# EAGLE design motor_driver (EAGLE 5.11)
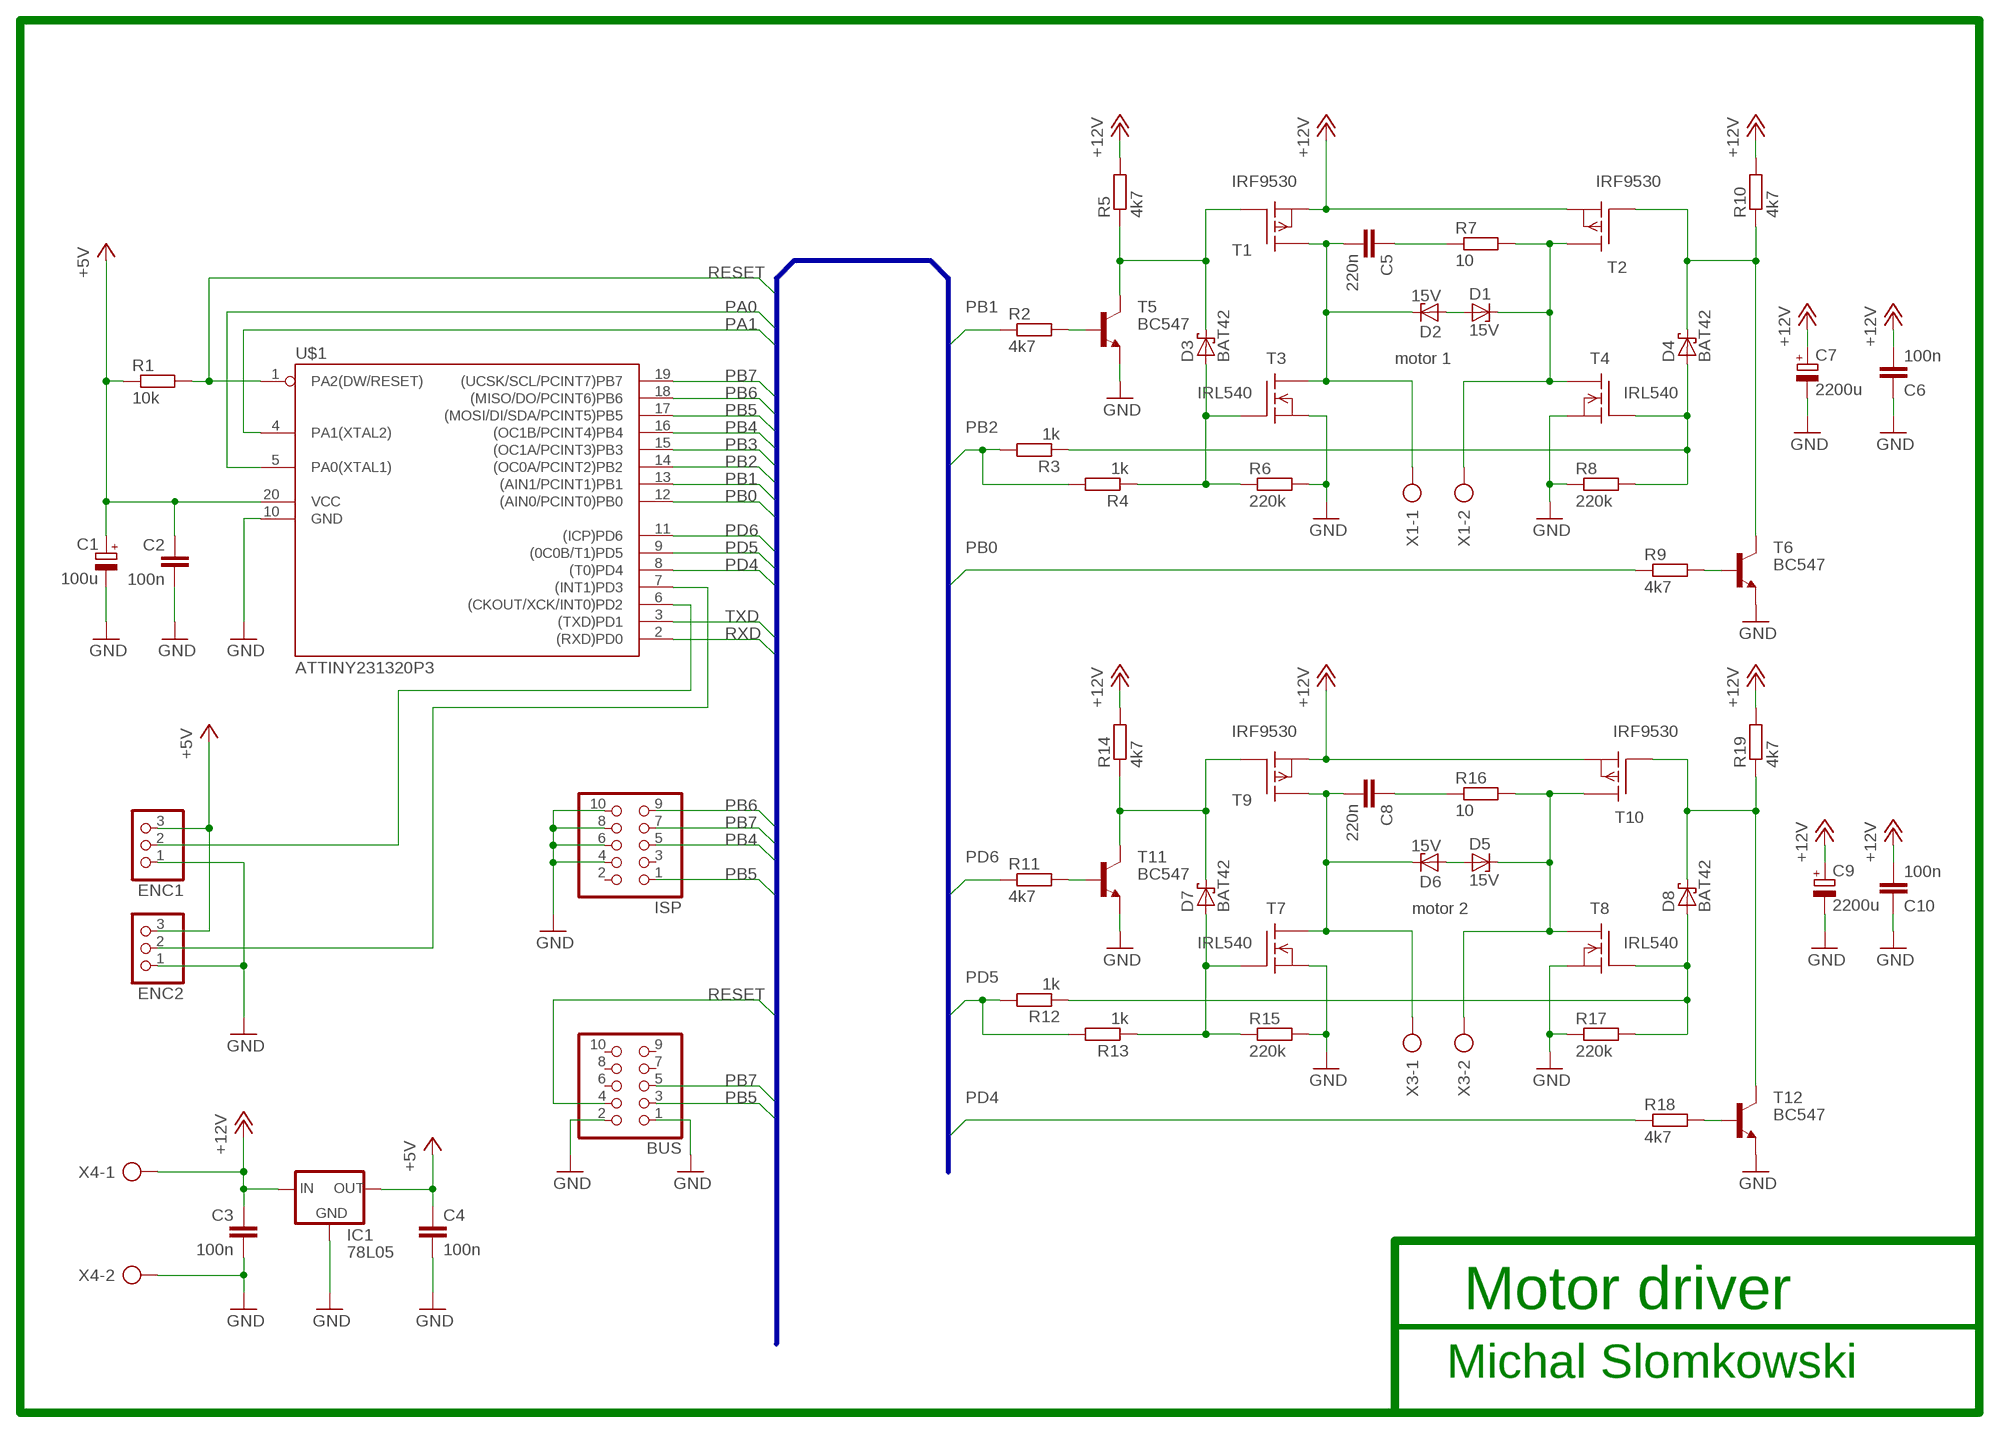
[diagram p0: schematic, sheet 1]

## Parts
BUS  PINHD-2X5  [2X05]
C1  100u  CPOL-EUE2.5-6  [E2,5-6]
C2  100n  C-EU050-035X075  [C050-035X075]
C3  100n  C-EU050-035X075  [C050-035X075]
C4  100n  C-EU050-035X075  [C050-035X075]
C5  220n  C-EU050-050X075  [C050-050X075]
C6  100n  C-EU050-050X075  [C050-050X075]
C7  2200u  CPOL-EUE5-13  [E5-13]
C8  220n  C-EU050-050X075  [C050-050X075]
C9  2200u  CPOL-EUE5-13  [E5-13]
C10  100n  C-EU050-050X075  [C050-050X075]
D1  15V  BZD23  [SOD81]
D2  15V  BZD23  [SOD81]
D3  BAT42  [DO35-10]
D4  BAT42  [DO35-10]
D5  15V  BZD23  [SOD81]
D6  15V  BZD23  [SOD81]
D7  BAT42  [DO35-10]
D8  BAT42  [DO35-10]
ENC1  PINHD-1X3  [1X03]
ENC2  PINHD-1X3  [1X03]
IC1  78L05  78LXX  [78LXX]
ISP  PINHD-2X5  [2X05]
R1  10k  R-EU_0204/7  [0204/7]
R2  4k7  R-EU_0204/7  [0204/7]
R3  1k  R-EU_0204/7  [0204/7]
R4  1k  R-EU_0204/7  [0204/7]
R5  4k7  R-EU_0204/7  [0204/7]
R6  220k  R-EU_0204/7  [0204/7]
R7  10  R-EU_0204/7  [0204/7]
R8  220k  R-EU_0204/7  [0204/7]
R9  4k7  R-EU_0204/7  [0204/7]
R10  4k7  R-EU_0204/7  [0204/7]
R11  4k7  R-EU_0204/7  [0204/7]
R12  1k  R-EU_0204/7  [0204/7]
R13  1k  R-EU_0204/7  [0204/7]
R14  4k7  R-EU_0204/7  [0204/7]
R15  220k  R-EU_0204/7  [0204/7]
R16  10  R-EU_0204/7  [0204/7]
R17  220k  R-EU_0204/7  [0204/7]
R18  4k7  R-EU_0204/7  [0204/7]
R19  4k7  R-EU_0204/7  [0204/7]
T1  IRF9530  [TO220]
T2  IRF9530  [TO220]
T3  IRL540  IRF540  [TO220]
T4  IRL540  IRF540  [TO220]
T5  BC547  [TO92]
T6  BC547  [TO92]
T7  IRL540  IRF540  [TO220]
T8  IRL540  IRF540  [TO220]
T9  IRF9530  [TO220]
T10  IRF9530  [TO220]
T11  BC547  [TO92]
T12  BC547  [TO92]
U$1  ATTINY231320P3  [DIL20]
X1  AK500/2  [AK500/2]
X3  AK500/2  [AK500/2]
X4  AK500/2  [AK500/2]

## Nets
+5V: C1.+ C2.1 C4.1 ENC1.3 ENC2.3 IC1.OUT R1.1 U$1.20(VCC)
+12V: C3.1 C6.2 C7.+ C9.+ C10.2 IC1.IN R5.2 R10.2 R14.2 R19.2 T1.3(S) T2.3(S) T9.3(S) T10.3(S) X4.1
GND: BUS.1 BUS.2 C1.- C2.2 C3.2 C4.2 C6.1 C7.- C9.- C10.1 ENC1.1 ENC2.1 IC1.GND ISP.4 ISP.6 ISP.8 ISP.10 R6.2 R8.1 R15.2 R17.1 T3.3(S) T4.3(S) T5.1(E) T6.1(E) T7.3(S) T8.3(S) T11.1(E) T12.1(E) U$1.10(GND) X4.2
N$2: D1.C R7.2 T2.2(D) T4.2(D) X1.2
N$3: D1.A D2.A
N$4: D3.C R5.1 T1.1(G) T5.3(C)
N$5: D4.C R10.1 T2.1(G) T6.3(C)
N$6: D4.A R3.1 R8.2 T4.1(G)
N$7: C5.1 R7.1
N$8: R2.2 T5.2(B)
N$9: R9.2 T6.2(B)
N$10: D3.A R4.1 R6.1 T3.1(G)
N$11: ENC2.2 U$1.7((INT1)PD3)
N$14: C5.2 D2.C T1.2(D) T3.2(D) X1.1
N$15: D5.C R16.2 T8.2(D) T10.2(D) X3.2
N$16: D7.C R14.1 T9.1(G) T11.3(C)
N$17: D8.C R19.1 T10.1(G) T12.3(C)
N$18: R11.2 T11.2(B)
N$19: D5.A D6.A
N$20: C8.1 R16.1
N$21: D8.A R12.1 R17.2 T8.1(G)
N$22: D7.A R13.1 R15.1 T7.1(G)
N$23: ENC1.2 U$1.6((CKOUT/XCK/INT0)PD2)
N$24: R18.2 T12.2(B)
N$35: C8.2 D6.C T7.2(D) T9.2(D) X3.1
PA0: U$1.5(PA0(XTAL1))
PA1: U$1.4(PA1(XTAL2))
PB0: R9.1 U$1.12((AIN0/PCINT0)PB0)
PB1: R2.1 U$1.13((AIN1/PCINT1)PB1)
PB2: R3.2 R4.2 U$1.14((OC0A/PCINT2)PB2)
PB3: U$1.15((OC1A/PCINT3)PB3)
PB4: ISP.5 U$1.16((OC1B/PCINT4)PB4)
PB5: BUS.3 ISP.1 U$1.17((MOSI/DI/SDA/PCINT5)PB5)
PB6: ISP.9 U$1.18((MISO/DO/PCINT6)PB6)
PB7: BUS.5 ISP.7 U$1.19((UCSK/SCL/PCINT7)PB7)
PD4: R18.1 U$1.8((T0)PD4)
PD5: R12.2 R13.2 U$1.9((0C0B/T1)PD5)
PD6: R11.1 U$1.11((ICP)PD6)
RESET: BUS.4 R1.2 U$1.1(PA2(DW/RESET))
RXD: U$1.2((RXD)PD0)
TXD: U$1.3((TXD)PD1)
Unconnected: BUS.6 BUS.7 BUS.8 BUS.9 BUS.10 ISP.2 ISP.3

## Buses
B$1

## Notes on the sheet
- motor 1
- motor 2
- Motor driver
- Michal Slomkowski

## Library data of the parts
BUS ISP = pinhead:PINHD-2X5: PIN HEADER
C1 C7 C9 = rcl:CPOL-EU: POLARIZED CAPACITOR, European symbol
C2-C6 C8 C10 = rcl:C-EU: CAPACITOR, European symbol
D1 D2 D5 D6 = diode:BZD23: Z DIODE
D3 D4 D7 D8 = diode:BAT42: DIODE barrier diode
ENC1 ENC2 = pinhead:PINHD-1X3: PIN HEADER
IC1 = v-reg:78LXX: VOLTAGE REGULATOR
R1-R19 = rcl:R-EU_: RESISTOR, European symbol
T1 T2 T9 T10 = transistor-fet:IRF9530: P-Channel Enhancement MOSFET (HEXFET); -100V; -12A; 0,3Ohm
T3 T4 T7 T8 = transistor-fet:IRF540: N-Channel Enhancement MOSFET (HEXFET); 100V; 28A; 0,077Ohm
T5 T6 T11 T12 = transistor:BC547: NPN TRANSISTOR
U$1 = robot:ATTINY2313
X1 X3 X4 = con-ptr500:AK500/2: CONNECTOR; OC_FARNELL: unknown; OC_NEWARK: unknown

## Board
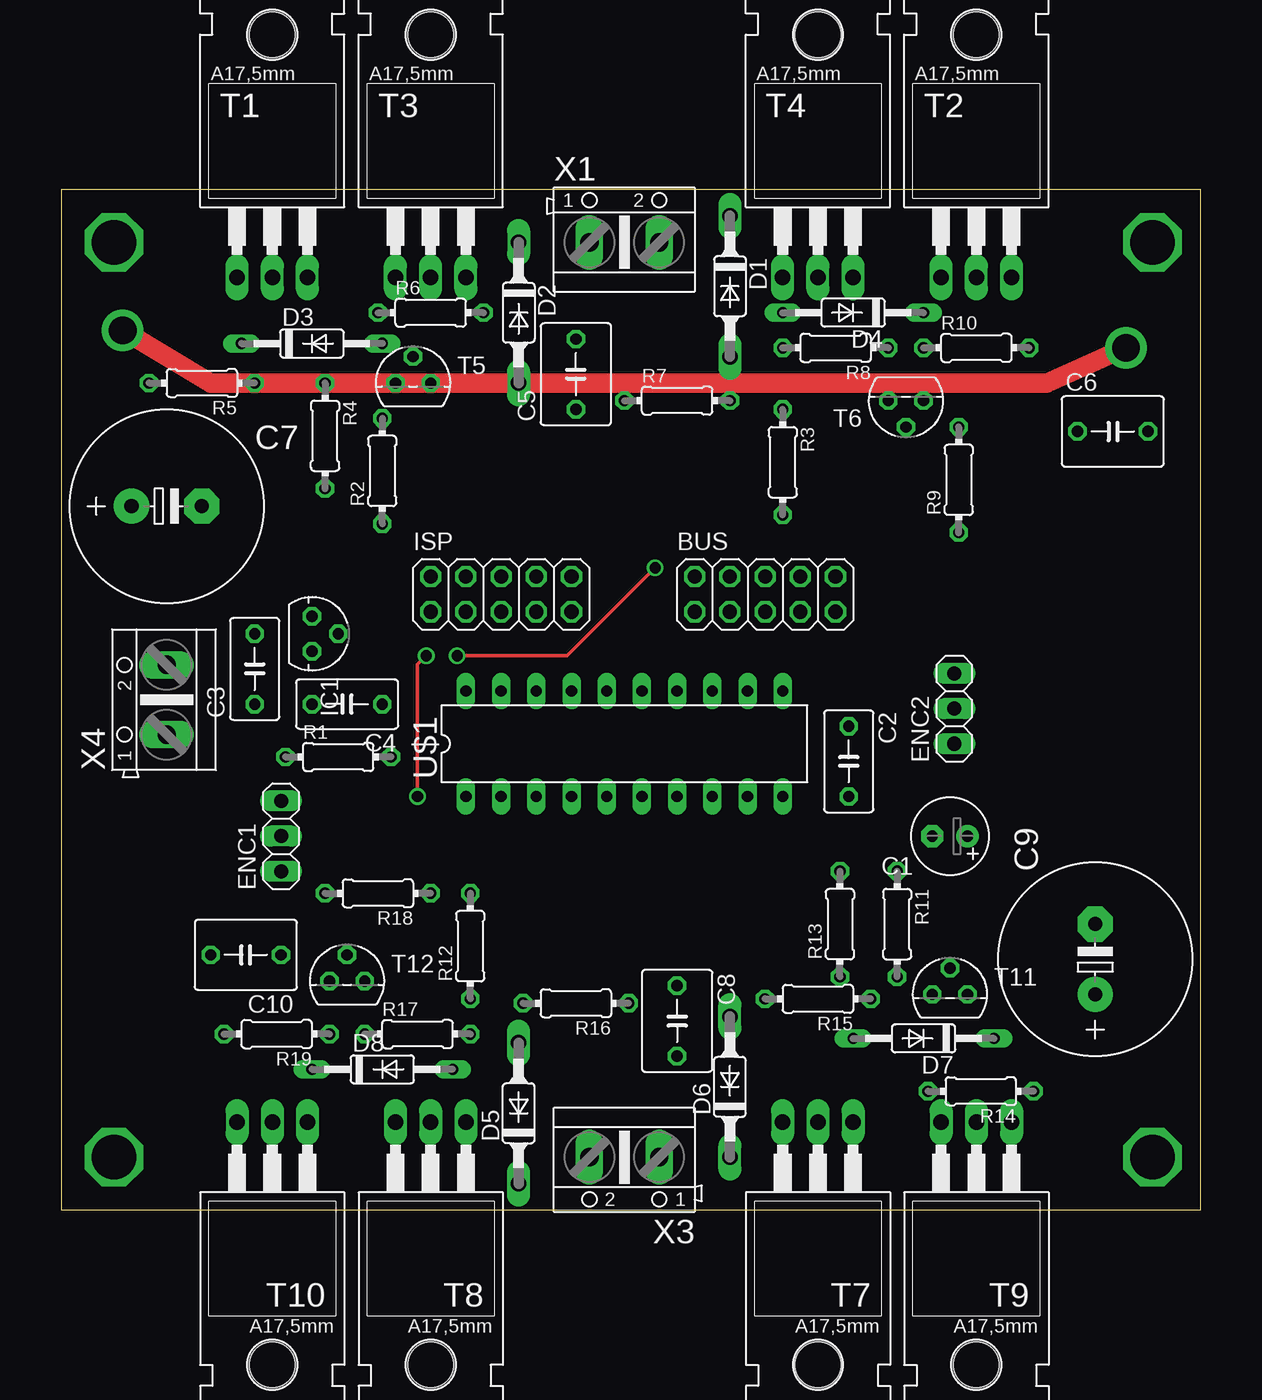
[diagram p1: board, top side]
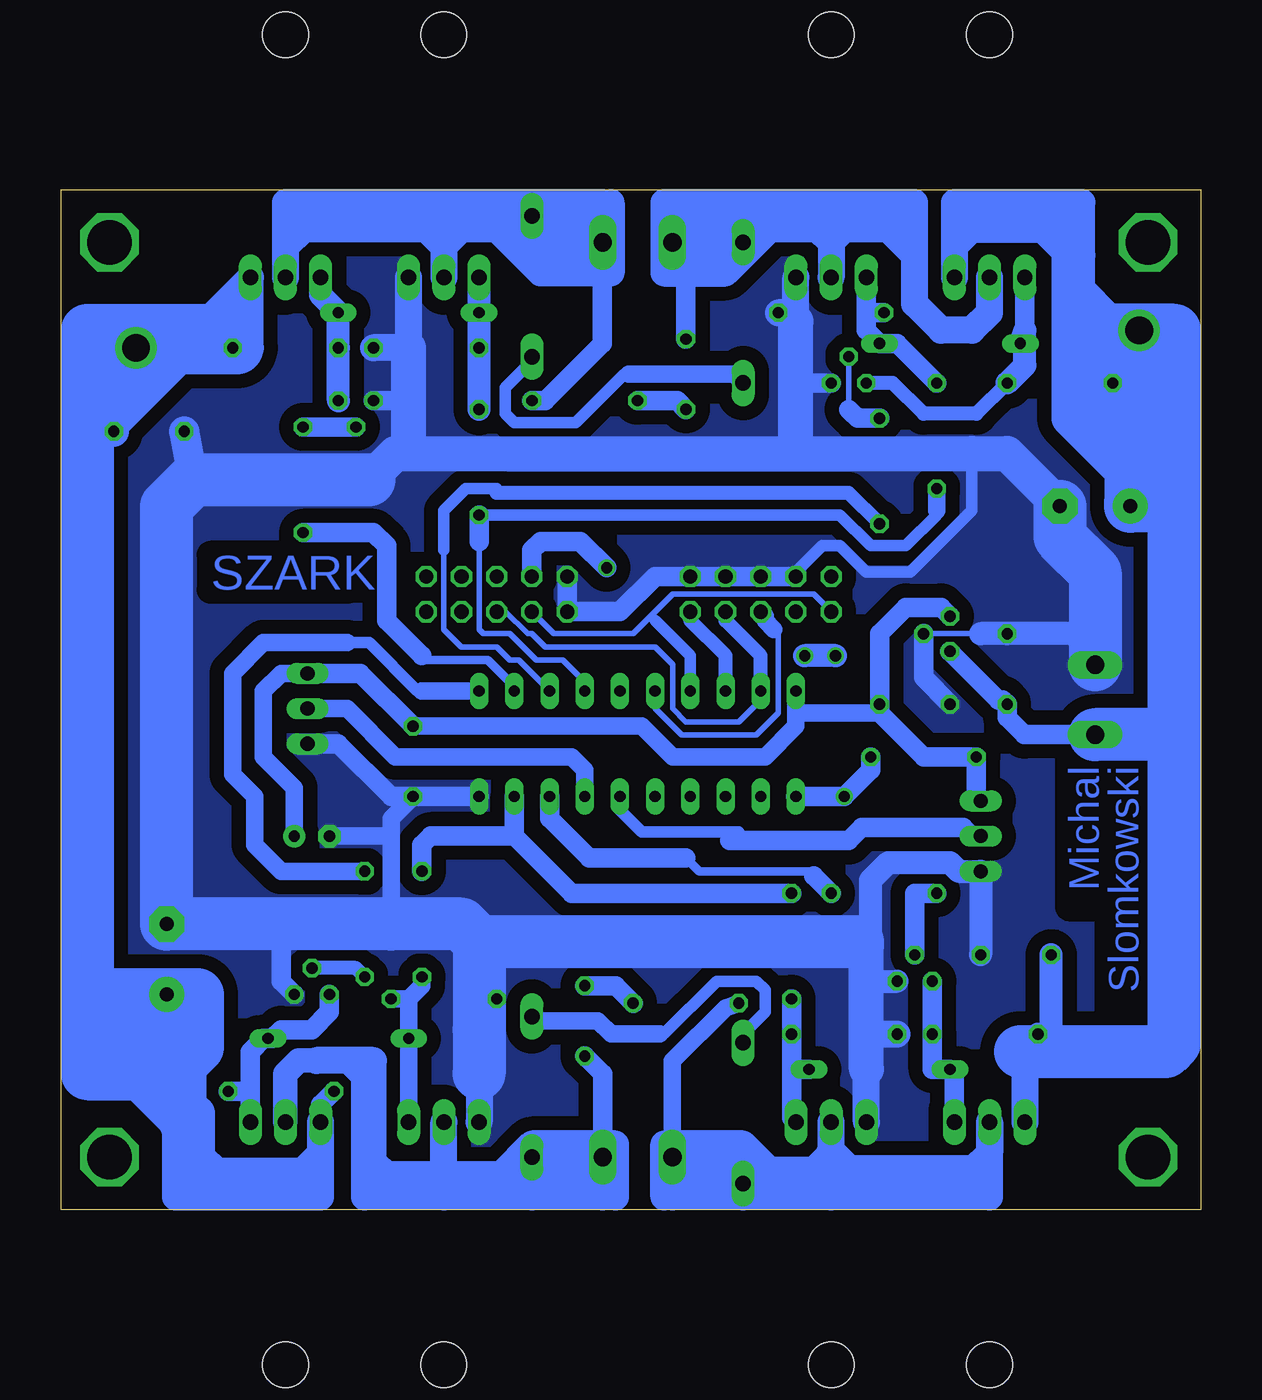
[diagram p2: board, bottom side, seen from below]

Size 82.22 x 73.65 mm. Coordinates in mm from the lower left corner, seen from the top.
Outline: 0,0 82.22,0 82.22,73.65 0,73.65 0,0
Copper layers (1*16): Top 0.035mm / dielectric 1.5mm / Bottom 0.035mm
Design rules "default": minimum track width 10mil, minimum drill 24mil, track to track 8mil, track to pad 8mil, pad to pad 8mil, via to via 8mil, smd to smd 8mil, copper to edge 40mil, drill to drill 8mil, minimum pad ring 10mil, minimum via ring 8mil, stop-mask expansion 4mil, vias tented up to drill 0mil, thermal gap 10mil

### Footprints (pad centres in the part's own frame; a part is rotated, then mirrored left to right if it is on the bottom)
2X05 = drill 1.016 octagon: 1 -5.08,-1.27; 2 -5.08,1.27; 3 -2.54,-1.27; 4 -2.54,1.27; 5 0,-1.27; 6 0,1.27; 7 2.54,-1.27; 8 2.54,1.27; 9 5.08,-1.27; 10 5.08,1.27
E2,5-6 = drill 0.813 pad 1.6 round: + -1.27,0 | drill 0.813 pad 1.6 octagon: - 1.27,0
C050-035X075 = drill 0.813 octagon: 1 -2.54,0; 2 2.54,0
C050-050X075 = drill 0.813 octagon: 1 -2.54,0; 2 2.54,0
E5-13 = drill 1.016 pad 2.54 round: + -2.54,0 | drill 1.016 pad 2.54 octagon: - 2.54,0
SOD81 = drill 1.118 long: A 5.08,0; C -5.08,0
DO35-10 = drill 0.813 long: A 5.08,0; C -5.08,0
1X03 = drill 1.016 long: 1 -2.54,0; 2 0,0; 3 2.54,0
78LXX = drill 0.813 octagon: GND 0,1.905; IN 1.27,0; OUT -1.27,0
0204/7 = drill 0.813 octagon: 1 -3.81,0; 2 3.81,0
TO220 = drill 1.118 long: 1 -2.54,-6.35; 2 0,-6.35; 3 2.54,-6.35 | hole 3.302: 0,11.176
TO92 = drill 0.813 octagon: 1 1.27,0; 2 0,1.905; 3 -1.27,0
DIL20 = drill 0.813 long: 1 -11.43,-3.81; 2 -8.89,-3.81; 3 -6.35,-3.81; 4 -3.81,-3.81; 5 -1.27,-3.81; 6 1.27,-3.81; 7 3.81,-3.81; 8 6.35,-3.81; 9 8.89,-3.81; 10 11.43,-3.81; 11 11.43,3.81; 12 8.89,3.81; 13 6.35,3.81; 14 3.81,3.81; 15 1.27,3.81; 16 -1.27,3.81; 17 -3.81,3.81; 18 -6.35,3.81; 19 -8.89,3.81; 20 -11.43,3.81
AK500/2 = drill 1.321 long: 1 -2.515,0; 2 2.515,0

### Placement (x,y rotation side)
BUS  50.8,44.45 0 top
C1  64.14,26.99 180 top
C2  56.83,32.38 270 top
C3  13.97,39.05 90 top
C4  20.64,36.51 180 top
C5  37.15,60.32 90 top
C6  75.88,56.2 0 top
C7  7.62,50.8 0 top
C8  44.45,13.65 270 top
C9  74.61,18.1 90 top
C10  13.34,18.41 180 top
D1  48.26,66.68 270 top
D2  33.02,64.77 270 top
D3  18.1,62.55 0 top
D4  57.15,64.77 180 top
D5  33.02,6.99 90 top
D6  48.26,8.89 90 top
D7  62.23,12.38 180 top
D8  23.18,10.16 0 top
ENC1  15.88,26.99 90 top
ENC2  64.45,36.2 90 top
IC1  18.1,41.59 270 top
ISP  31.75,44.45 0 top
R1  20,32.7 0 top
R2  23.18,53.34 90 top
R3  52.07,53.98 270 top
R4  19.05,55.88 270 top
R5  10.16,59.69 180 top
R6  26.67,64.77 0 top
R7  44.45,58.42 0 top
R8  55.88,62.23 180 top
R9  64.77,52.7 90 top
R10  66.04,62.23 0 top
R11  60.33,20.64 270 top
R12  29.53,19.05 90 top
R13  56.2,20.64 90 top
R14  66.36,8.57 180 top
R15  54.61,15.24 180 top
R16  37.15,14.92 180 top
R17  25.72,12.7 0 top
R18  22.86,22.86 180 top
R19  15.56,12.7 180 top
T1  15.24,73.66 0 top
T2  66.04,73.66 0 top
T3  26.67,73.66 0 top
T4  54.61,73.66 0 top
T5  25.4,59.69 0 top
T6  60.96,58.42 180 top
T7  54.61,0 180 top
T8  26.67,0 180 top
T9  66.04,0 180 top
T10  15.24,0 180 top
T11  64.14,15.56 0 top
T12  20.64,16.51 0 top
U$1  40.64,33.66 0 top
X1  40.64,69.85 0 top
X3  40.64,3.81 180 top
X4  7.62,36.83 90 top

### Tracks (layer width: path | path; a pad name or v marks a point on that pad's centre or on a via)
+5V
  Bottom 1.27: C2.1 40.32,34.92 38.1,32.7 31.43,32.7 29.21,34.92 29.21,35.88 | C1.+ 65.41,30.48 67.63,32.7 67.63,37.46 66.36,38.73 ENC2.3 | 29.21,35.88 U$1.20 | 23.18,35.88 29.21,35.88
  Bottom 1.422: IC1.OUT 18.73,43.5 21.27,43.5 23.18,41.59 C4.1 23.18,35.88 20,32.7 R1.1 16.19,29.53 ENC1.3 | ENC2.3 60.64,38.73 C2.1
+12V  (via drill 2)
  Top 1.422: v76.83,62.23 71.12,59.69 10.79,59.69 v4.45,63.5
  Bottom 1.422: IC1.IN 14.61,36.83 14.29,36.83 C3.1 13.97,35.56 12.72,34.31 X4.1 | R14.2 63.5,7.62 T9.3
  Bottom 1.676: 12.7,11.43 R19.2 | 10.79,11.43 C10.2
  Bottom 1.93: 78.42,10.48 73.98,6.03 73.98,0.95 63.5,0.95 63.5,2.54 | 69.53,62.23 68.58,62.23 T2.3 71.44,64.45 | 17.78,69.53 17.78,72.71 8.57,72.71 8.57,68.9 8.89,68.58 | T10.3 12.7,11.11 13.02,11.43 | 63.5,4.13 63.5,2.86 63.82,2.54 | 63.5,4.13 T9.3 | 63.5,4.13 64.77,2.86 | 17.78,69.53 T1.3 | 17.78,69.53 16.51,70.8 11.43,70.8 9.53,68.9
  Bottom 2.184: C6.2 80.01,56.2 80.33,56.52 | 73.98,6.03 73.98,7.62 73.66,7.94
  Bottom 2.54: 74.3,8.89 72.39,6.99 72.39,3.81 71.12,2.54 63.82,2.54 | 8.89,68.58 8.89,66.36 6.67,64.14 6.67,63.5 | 9.53,69.53 9.53,68.9 9.53,57.15 5.71,53.34 5.71,51.12
  Bottom 3.81: C9.+ 74.3,8.89 | v76.83,62.23 R10.2 69.53,62.23 | v76.83,62.23 73.98,62.23 80.33,55.88 | v76.83,62.23 80.33,62.23 | 80.33,62.23 80.33,56.52 80.33,55.88 | 80.33,15.56 C9.+ | X4.1 1.93,34.31 1.91,34.29 | 1.91,34.29 1.91,12.06 2.54,11.43 10.79,11.43 12.7,11.43 13.02,11.43 | 1.91,50.8 C7.+ | 1.91,34.29 1.91,50.8 | 1.91,50.8 1.91,59.37 | 1.91,59.37 1.91,63.5 v4.45,63.5 6.67,63.5 6.99,63.5 | R5.2 3.17,59.69 2.86,60.01 2.54,60.01 1.91,59.37 | 80.33,55.88 80.33,15.56 | 80.33,15.56 80.33,9.84 74.61,9.84 | C9.+ 72.39,15.56 72.39,11.75 73.66,10.48 73.66,7.94 | 80.33,62.23 80.33,63.5 69.85,63.5
GND
  Bottom 0.406: 15.88,41.59 IC1.GND
  Bottom 0.813: ISP.4 29.21,46.04 27.3,47.94 26.04,47.94 24.13,46.04 20.95,46.04 16.51,50.48 16.51,54.61 | R15.2 51.75,12.7 52.07,13.02
  Bottom 1.27: C2.2 58.42,28.26 58.42,26.99 | 58.42,20.64 58.42,26.99 | 58.42,26.99 C1.-
  Bottom 1.422: 29.21,59.69 T5.1 | 57.15,58.42 T6.1 | ISP.4 ISP.6 ISP.8 ISP.10 39.37,45.72 41.91,43.18 BUS.1 BUS.2 | IC1.GND 20,38.42 C4.2 | U$1.10 C2.2 58.42,29.84 62.23,33.66 ENC2.1 | T11.1 66.36,16.51 66.36,20.32 66.04,20.64
  Bottom 1.676: 24.13,16.51 T12.1 | 7.62,41.59 7.94,41.27 8.89,41.27 9.21,41.59 C3.2 15.88,41.59 | 25.72,19.37 23.81,19.69 23.81,23.81 22.54,25.08 18.1,25.08 17.46,24.45 ENC1.1 C10.1
  Bottom 1.778: 24.13,19.05 24.45,19.05 24.77,19.37
  Bottom 1.93: T4.3 57.15,62.23 R8.1 | T8.3 24.13,10.16 | 24.13,12.7 R17.1 | 52.07,9.84 T7.3 | 29.21,64.14 29.21,64.77 | 29.21,64.77 T3.3 | 29.21,64.77 R6.2
  Bottom 2.184: 72.71,52.7 C6.1
  Bottom 2.54: 29.21,54.61 29.21,59.69 29.21,64.14 | 57.15,54.61 29.21,54.61 | 57.15,54.61 57.15,58.42 57.15,62.23 | C7.- 13.97,54.61 16.51,54.61 29.21,54.61 | 24.13,10.16 24.13,12.7 24.13,16.51 24.13,19.05 | 57.15,54.61 58.1,54.61 60.01,52.7
  Bottom 3.81: X4.2 7.62,41.59 7.62,46.04 10.16,48.58 C7.- | 60.01,52.7 72.71,52.7 74.61,50.8 C9.- 66.04,20.64 58.42,20.64 53.34,20.64 52.07,19.37 | 24.77,19.37 25.72,19.37 52.07,19.37 | 52.07,19.37 52.07,13.02 52.07,9.84
  pour Bottom (isolate 1.016, no thermals): 8.89,72.39 70.8,72.39 70.8,64.45 80.96,54.29 80.96,12.7 69.53,1.27 11.43,1.27 11.43,10.48 1.27,10.48 1.27,64.45 8.57,64.45 8.57,72.07
N$1
  Bottom 1.93: 73.03,1.59 73.03,3.18
N$2
  Bottom 1.422: R7.2 47.31,58.42 43.18,62.55 43.18,69.83 X1.2
  Bottom 1.93: 66.04,69.53 66.04,72.71 54.61,72.71 | 54.61,72.71 54.61,70.8 | 54.61,70.8 54.61,69.53 | 48.26,72.71 D1.C | 48.26,72.71 54.61,72.71 | X1.2 43.16,72.68 43.18,72.71 | 43.18,72.71 48.26,72.71 | 66.04,69.53 T2.2 | 66.04,69.53 64.77,70.8 54.61,70.8 | 54.61,70.8 53.34,70.8 | 53.34,70.8 50.8,70.8 47.62,67.63 42.55,67.63 42.55,72.71 43.18,72.71 | T4.2 54.61,68.58 54.61,69.53 | 54.61,69.53 56.2,71.12 | 54.61,69.53 53.34,70.8
N$3
  Bottom 0.813: D1.A 48.26,61.28 50.16,59.37 50.16,57.47 49.53,56.83 45.09,56.83 41.59,60.32 41.27,60.32
  Bottom 1.27: 41.27,60.32 33.66,60.32 D2.A
N$4
  Bottom 1.016: T5.3 22.23,59.69 20,57.47 16.19,57.47 R5.1
  Bottom 1.422: T1.1 12.7,63.18 D3.C
  Bottom 1.676: R5.1 12.7,60.96 12.7,63.5 D3.C
N$5
  Bottom 1.676: T6.3 R10.1 D4.C 63.5,66.04 T2.1
N$6
  Bottom 1.676: T4.1 D4.A R8.2 R3.1
N$7
  Bottom 1.422: R7.1 37.78,58.42 C5.1
N$8
  Bottom 0.406: 25.4,57.79 T5.2
  Bottom 1.422: R2.2 24.77,57.15 25.24,57.63 25.4,57.79
N$9
  Bottom 1.422: T6.2 R9.2
N$10
  Bottom 1.422: 24.13,64.77 24.13,63.5 D3.A 21.91,62.55 R4.1 | 24.13,64.77 T3.1 | 24.13,64.77 R6.1
N$11
  Bottom 1.27: U$1.7 44.45,31.75 45.4,32.7 58.1,32.7 61.59,36.2 ENC2.2
N$12
  Bottom 1.93: 43.18,3.81 46.99,3.81 47.31,3.49
N$13
  Bottom 1.93: 30.48,2.54 37.15,2.54
N$14
  Bottom 1.422: 37.15,69.85 C5.2
  Bottom 1.93: X1.1 37.15,69.85 D2.C 33.02,72.71 | 26.67,72.71 26.67,69.85 | 26.67,69.85 T3.2 | 26.67,72.71 33.02,72.71 | T1.2 15.24,64.77 16.51,63.5 18.73,63.5 20.64,65.41 20.64,68.9 | 20.64,68.9 20.64,72.71 26.67,72.71 | 33.02,72.71 38.73,72.71 38.73,67.63 34.29,67.63 31.11,70.8 27.62,70.8 26.67,69.85 | 26.67,69.85 26.04,70.48 | 25.72,70.8 22.54,70.8 20.64,68.9
N$15
  Bottom 1.27: X3.2 38.12,10.77 34.29,14.6 R16.2
  Bottom 1.93: X3.2 38.12,0.98 38.1,0.95 | 26.67,0.95 33.02,0.95 | 33.02,0.95 38.1,0.95 | 26.67,0.95 26.67,4.13 | 26.67,4.13 T8.2 | 33.02,0.95 D5.C | 26.67,0.95 15.24,0.95 T10.2 15.24,4.13 16.51,2.86 | 38.1,0.95 38.73,0.95 38.73,4.76 33.02,4.76 31.11,2.86 27.94,2.86 26.67,4.13
  Bottom 2.184: 15.88,2.86 25.4,2.86 26.67,4.13
N$16
  Bottom 1.422: 68.9,8.57 68.58,8.57 T9.1 | 68.9,8.57 R14.1 | 68.9,8.57 68.58,8.89 68.58,11.43 67.63,12.38 D7.C 66.99,12.38 66.36,13.02 64.14,13.02 62.87,14.29 T11.3
N$17
  Bottom 1.422: T12.3 R19.1 19.37,10.16 D8.C 17.78,9.84 T10.1
N$18
  Bottom 1.016: T11.2 60.96,17.46 R11.2
N$19
  Bottom 0.813: D5.A 33.02,12.7 31.43,14.29 31.43,15.88 32.07,16.51 34.92,16.51 38.73,12.7 39.05,12.7
  Bottom 1.27: 39.05,12.7 42.55,12.7 43.5,13.65 47.94,13.65 D6.A
N$20
  Bottom 1.422: C8.1 42.23,16.19 R16.1
N$21
  Bottom 1.422: R12.1 R17.2 29.53,10.16 | 29.53,10.16 29.53,6.67 T8.1 | 29.53,10.16 D8.A
N$22
  Bottom 1.27: T7.1 D7.A 57.15,15.24 | 57.15,15.24 56.2,16.19 R13.1 | 57.15,15.24 R15.1
N$23
  Bottom 0.813: U$1.6 41.91,28.89 40.32,27.3 33.34,27.3 33.97,26.67
  Bottom 1.422: ENC1.2 16.51,26.99 17.14,27.62 24.45,27.62 25.4,26.67 33.97,26.67
N$24
  Bottom 1.422: T12.2 20.64,22.86 R18.2
N$26  (via drill 3.2)
  other vias: 3.81,3.81
N$27  (via drill 3.2)
  other vias: 3.81,69.85
N$28  (via drill 3.2)
  other vias: 78.74,69.85
N$29  (via drill 3.2)
  other vias: 78.74,3.81
N$30
  Bottom 1.93: 32.7,3.49 37.15,3.49
N$31
  Bottom 1.93: 9.21,71.12 11.11,71.12
N$32
  Bottom 1.93: 20.95,71.76 23.18,71.76
N$33
  Bottom 2.54: 7.94,62.87 7.94,57.47 3.81,53.34
N$34
  Bottom 2.54: 6.67,62.55 6.67,59.37 2.86,55.56
N$35
  Bottom 1.422: X3.1 43.16,9.82 C8.2
  Bottom 1.778: T9.2 66.04,9.84 65.09,10.79 63.82,10.79 61.59,10.79 60.33,9.53
  Bottom 1.93: X3.1 43.16,0.98 43.18,0.95 | 60.33,9.53 60.33,0.95 54.61,0.95 | 43.18,0.95 48.26,0.95 | 48.26,0.95 54.61,0.95 | 48.26,0.95 D6.C | 54.61,0.95 T7.2 | 63.82,10.79 59.69,10.79 59.69,3.49 58.74,2.54 50.48,2.54 | 50.48,2.54 43.5,2.54 | 50.48,2.54 48.26,4.76 42.23,4.76 42.23,0.95 43.18,0.95
N$36
  Bottom 1.93: 31.43,71.44 37.78,71.44
N$38
  Bottom 3.81: 75.25,13.02 78.42,13.02 78.74,13.33
N$39
  Bottom 1.93: 34.29,68.9 37.78,68.9
N$40
  Bottom 1.93: 43.5,71.12 50.48,71.12
N$41
  Bottom 2.184: 43.5,69.53 48.58,69.53
PB0
  Bottom 0.61: 56.2,40 56.2,40.32 55.88,39.69 51.44,39.69 49.85,38.1 49.85,37.78 U$1.12
  Bottom 1.422: R9.1 59.69,48.89 58.74,47.94 58.74,42.55 56.2,40
PB1
  Bottom 0.406: 54.61,47.62 54.61,41.91 53.34,40.64 50.8,40.64 49.85,39.69 49.21,39.69 U$1.13
  Bottom 0.813: 50.8,51.75 50.8,52.07 53.02,52.07 54.61,50.48 54.61,47.62
  Bottom 1.016: R2.1 25.4,51.75 50.8,51.75
PB2
  Bottom 0.406: U$1.14 44.45,38.1 46.04,39.69 47.94,39.69 49.85,41.59 51.75,41.59 52.07,41.91 52.07,48.26
  Bottom 0.813: R3.2 26.04,50.16 23.81,47.94 21.27,47.94 19.05,50.16 19.05,50.48
  Bottom 1.27: 19.05,50.48 R4.2
  Bottom 1.422: R3.2 52.07,48.26
PB4
  Bottom 0.406: U$1.16 39.37,36.2 37.47,34.29 32.07,34.29 30.48,35.88 30.48,41.59 30.8,41.91
  Bottom 1.27: 30.8,41.91 31.43,42.55 31.43,42.86 ISP.5
PB5
  Bottom 0.406: ISP.1 27.94,44.45 38.1,44.45 39.69,42.86 | BUS.3 46.67,41.59 40.96,41.59 39.69,42.86 | 39.69,42.86 39.37,42.55
  Bottom 0.813: U$1.17 36.83,40 39.37,42.55
PB6
  Bottom 1.016: U$1.18 34.29,40 36.83,42.55 ISP.9
PB7
  Bottom 0.406: BUS.5 50.16,43.18 48.58,41.59 48.26,41.59 47.31,40.64 39.37,40.64 38.1,39.37 38.1,36.2 37.15,35.24 33.34,35.24 31.75,36.83
  Bottom 0.813: U$1.19 31.75,36.83
  Bottom 1.016: U$1.19 31.75,40 34.29,42.55 ISP.7
PD4
  Bottom 0.61: 37.15,25.4 36.2,24.45 27.94,24.45 27.94,24.13
  Bottom 1.422: U$1.8 46.99,28.26 44.13,25.4 37.15,25.4 | R18.1 27.94,24.13
PD5
  Bottom 1.422: R12.2 45.4,22.86 49.53,26.99 | 49.53,26.99 U$1.9 | R13.2 56.2,26.35 55.56,26.99 49.53,26.99
PD6
  Bottom 0.813: 61.59,40.96 60.01,40.96 56.52,37.46 56.2,37.46
  Bottom 1.27: R11.1 66.36,24.45 68.26,26.35 68.26,29.84 69.85,31.43 69.85,38.73 67.63,40.96 61.59,40.96 | 56.2,37.46 U$1.11
RESET  (via drill 0.8)
  Top 0.254: v42.86,46.35 36.51,40 v28.57,40 | v25.72,29.84 25.72,39.37 v26.35,40
  Bottom 1.422: BUS.4 48.26,47.62 47.62,48.26 44.77,48.26 v42.86,46.35 | U$1.1 v25.72,29.84 23.81,31.75 R1.2
  Bottom 1.676: v26.35,40 v28.57,40

### Text on the board
Bottom: SZARK | Slomkowski | Michal